# EAGLE design Integrator (EAGLE 6.4)
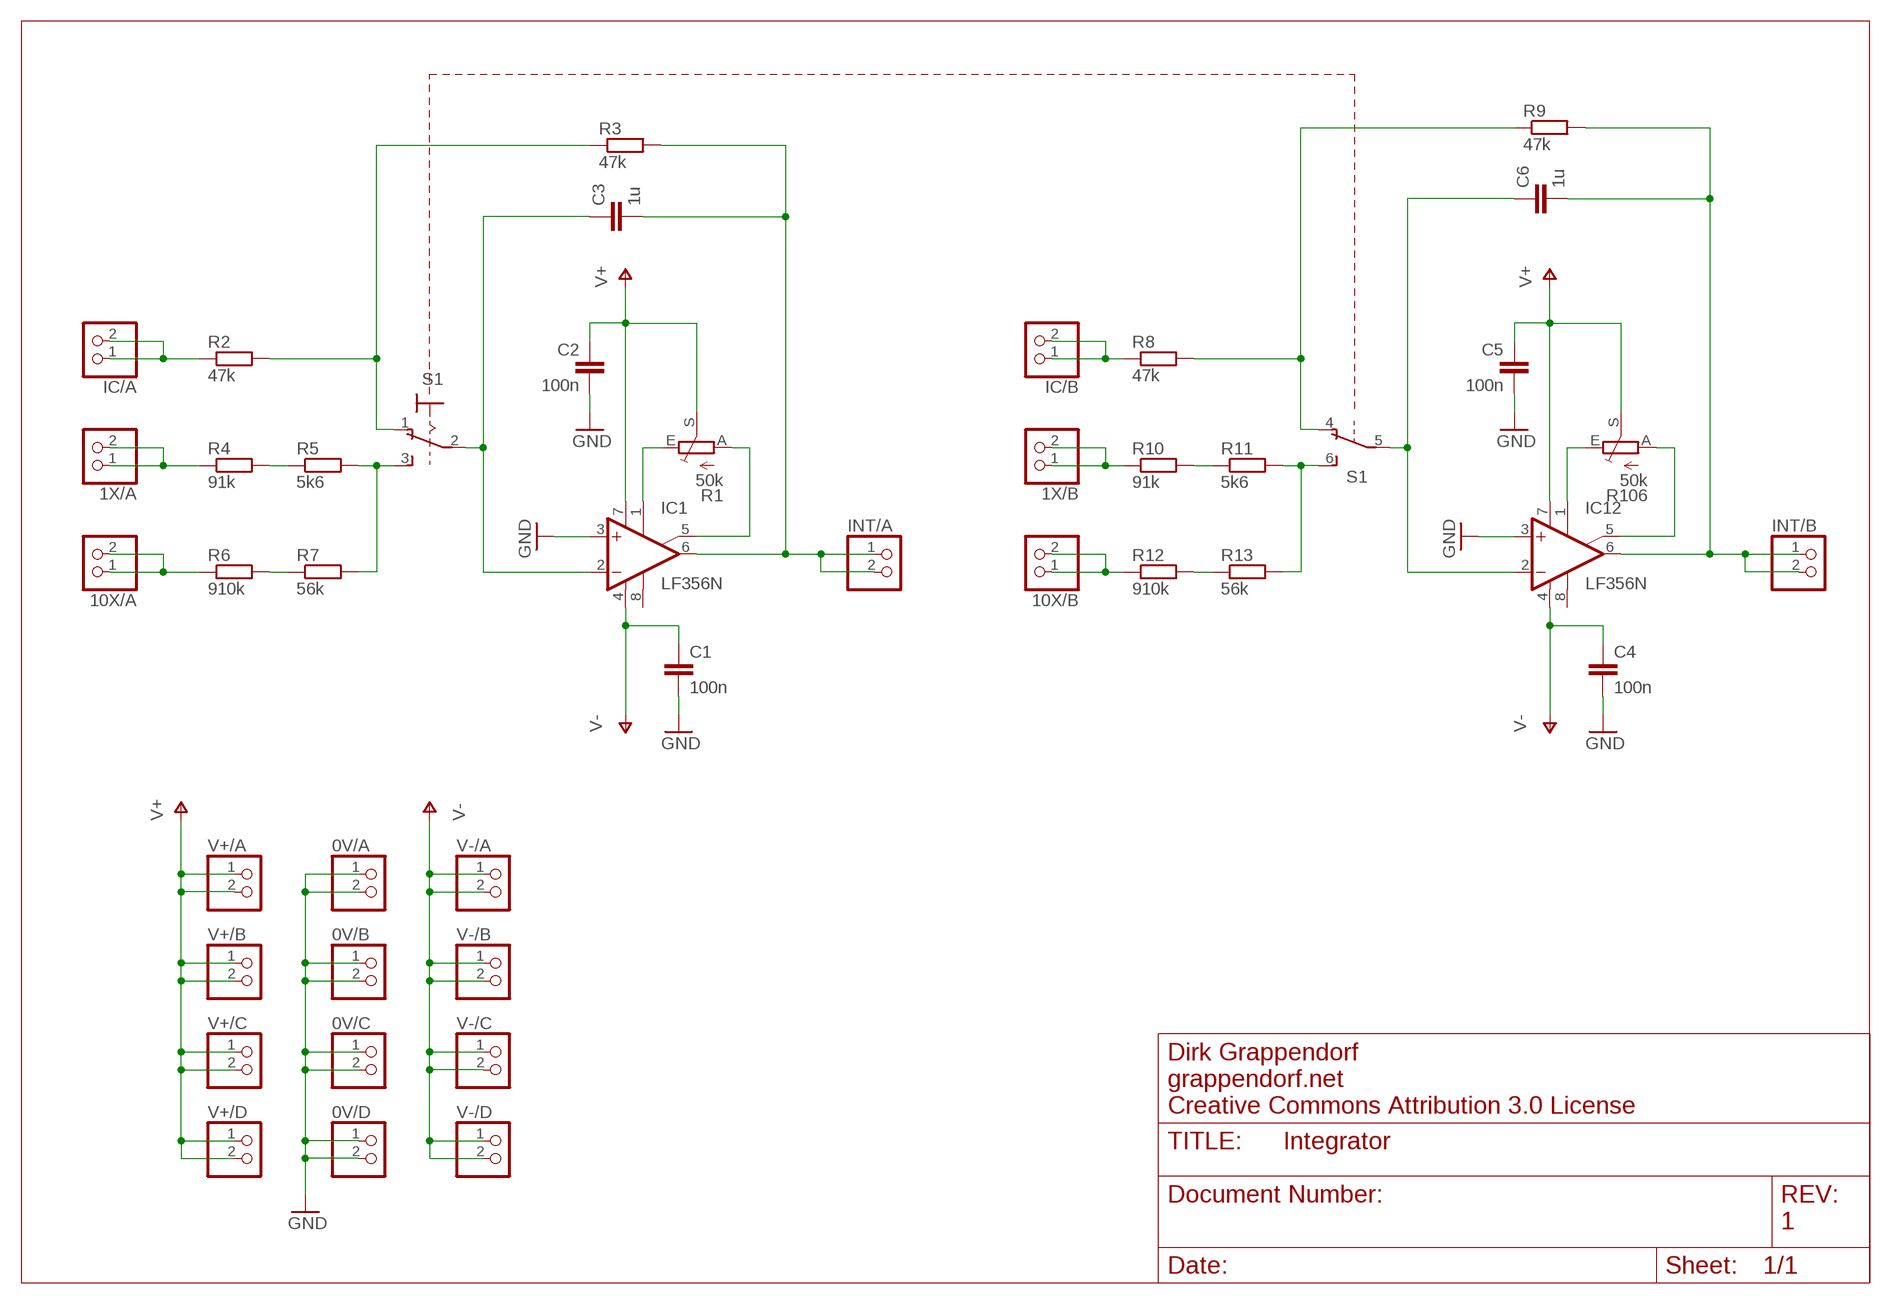
[diagram p0: schematic, sheet 1]

## Parts
0V/A  PINHD-1X2  [1X02]
0V/B  PINHD-1X2  [1X02]
0V/C  PINHD-1X2  [1X02]
0V/D  PINHD-1X2  [1X02]
1X/A  PINHD-1X2  [1X02]
1X/B  PINHD-1X2  [1X02]
10X/A  PINHD-1X2  [1X02]
10X/B  PINHD-1X2  [1X02]
C1  100n  C-EU025-025X050  [C025-025X050]
C2  100n  C-EU025-025X050  [C025-025X050]
C3  1u  C-EU050-035X075  [C050-035X075]
C4  100n  C-EU025-025X050  [C025-025X050]
C5  100n  C-EU025-025X050  [C025-025X050]
C6  1u  C-EU050-035X075  [C050-035X075]
IC1  LF356N  [DIL08]
IC12  LF356N  [DIL08]
IC/A  PINHD-1X2  [1X02]
IC/B  PINHD-1X2  [1X02]
INT/A  PINHD-1X2  [1X02]
INT/B  PINHD-1X2  [1X02]
R1  50k  TRIM_EU-LI15  [LI15]
R2  47k  R-EU_0207/7  [0207/7]
R3  47k  R-EU_0207/7  [0207/7]
R4  91k  R-EU_0207/7  [0207/7]
R5  5k6  R-EU_0207/7  [0207/7]
R6  910k  R-EU_0207/7  [0207/7]
R7  56k  R-EU_0207/7  [0207/7]
R8  47k  R-EU_0207/7  [0207/7]
R9  47k  R-EU_0207/7  [0207/7]
R10  91k  R-EU_0207/7  [0207/7]
R11  5k6  R-EU_0207/7  [0207/7]
R12  910k  R-EU_0207/7  [0207/7]
R13  56k  R-EU_0207/7  [0207/7]
R106  50k  TRIM_EU-LI15  [LI15]
S1  REICHELT-MS_500H  [REICHELT-MS_500H]
V+/A  PINHD-1X2  [1X02]
V+/B  PINHD-1X2  [1X02]
V+/C  PINHD-1X2  [1X02]
V+/D  PINHD-1X2  [1X02]
V-/A  PINHD-1X2  [1X02]
V-/B  PINHD-1X2  [1X02]
V-/C  PINHD-1X2  [1X02]
V-/D  PINHD-1X2  [1X02]

## Nets
GND: 0V/A.1 0V/A.2 0V/B.1 0V/B.2 0V/C.1 0V/C.2 0V/D.1 0V/D.2 C1.2 C2.2 C4.2 C5.2 IC1.3(+IN) IC12.3(+IN)
N$1: IC1.1(ON1) R1.E
N$2: IC1.5(ON2) R1.A
N$3: C3.2 IC1.6(OUT) INT/A.1 INT/A.2 R3.2
N$4: C3.1 IC1.2(-IN) S1.2(1:P)
N$5: 10X/A.1 10X/A.2 R6.1
N$6: 1X/A.1 1X/A.2 R4.1
N$7: IC/A.1 IC/A.2 R2.1
N$8: IC12.1(ON1) R106.E
N$9: IC12.5(ON2) R106.A
N$10: C6.2 IC12.6(OUT) INT/B.1 INT/B.2 R9.2
N$11: C6.1 IC12.2(-IN) S1.5(B:P)
N$12: 1X/B.1 1X/B.2 R10.1
N$13: 10X/B.1 10X/B.2 R12.1
N$14: IC/B.1 IC/B.2 R8.1
N$15: R4.2 R5.1
N$16: R6.2 R7.1
N$17: R10.2 R11.1
N$18: R12.2 R13.1
N$19: R5.2 R7.2 S1.3(1:S)
N$20: R11.2 R13.2 S1.6(B:S)
N$21: R2.2 R3.1 S1.1(1:O)
N$22: R8.2 R9.1 S1.4(B:O)
V+: C2.1 C5.1 IC1.7(V+) IC12.7(V+) R1.S R106.S V+/A.1 V+/A.2 V+/B.1 V+/B.2 V+/C.1 V+/C.2 V+/D.1 V+/D.2
V-: C1.1 C4.1 IC1.4(V-) IC12.4(V-) V-/A.1 V-/A.2 V-/B.1 V-/B.2 V-/C.1 V-/C.2 V-/D.1 V-/D.2
Unconnected: IC1.8(OPT) IC12.8(OPT)

## Notes on the sheet
- Dirk Grappendorf
- grappendorf.net
- Creative Commons Attribution 3.0 License
- 1

## Library data of the parts
0V/A 0V/B 0V/C 0V/D 1X/A 1X/B 10X/A 10X/B IC/A IC/B INT/A INT/B V+/A V+/B V+/C V+/D V-/A V-/B V-/C V-/D = pinhead:PINHD-1X2: PIN HEADER
C1-C6 = rcl:C-EU: CAPACITOR, European symbol
IC1 IC12 = linear:LF356: OP AMP
R1 R106 = pot:TRIM_EU-: POTENTIOMETER
R2-R13 = rcl:R-EU_: RESISTOR, European symbol
S1 = grapelabs-switches:REICHELT-MS_500H: TOGGLE SWITCH distributor RS Components

## Board
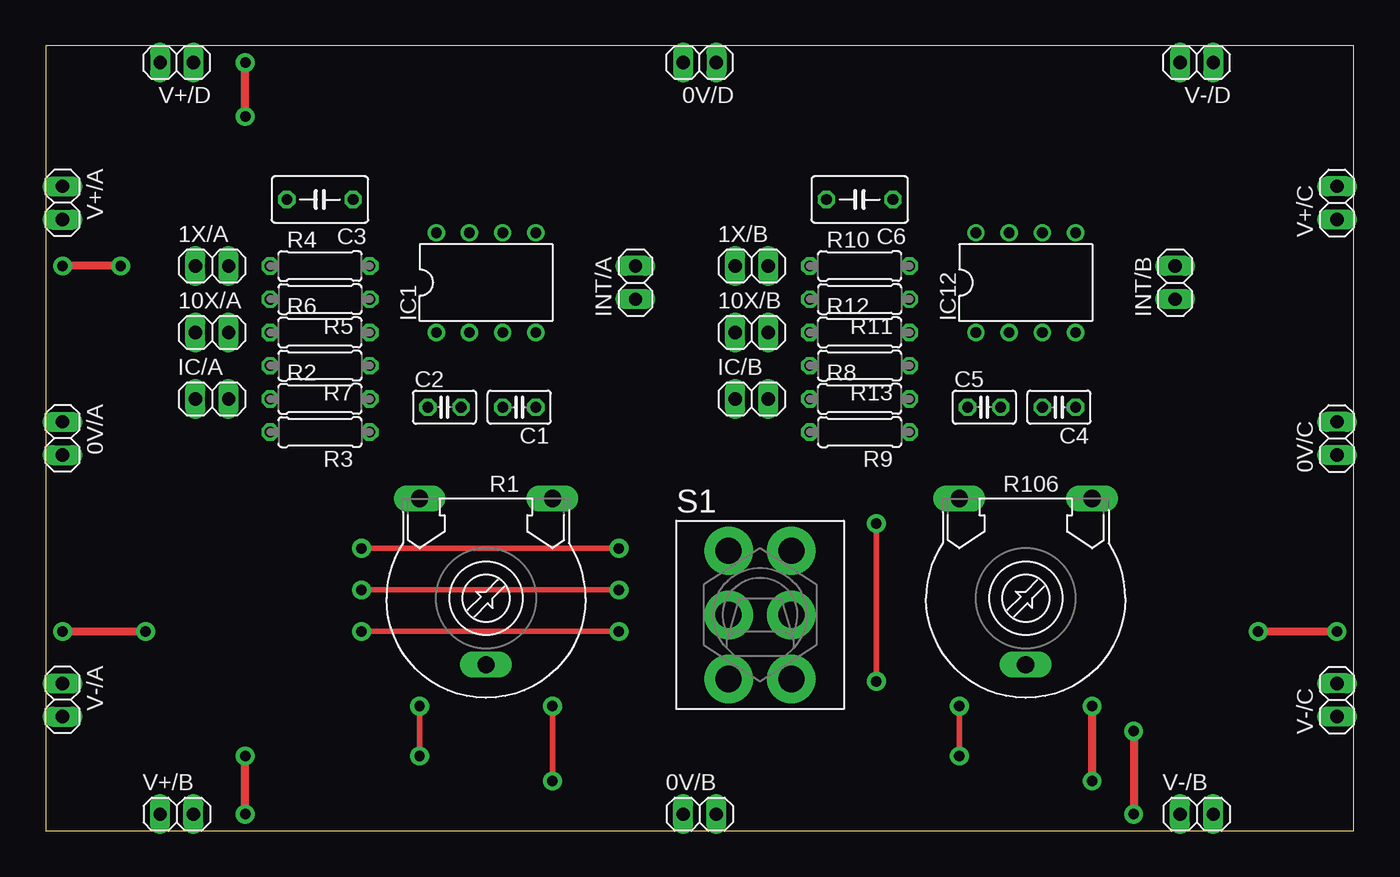
[diagram p1: board, top side]
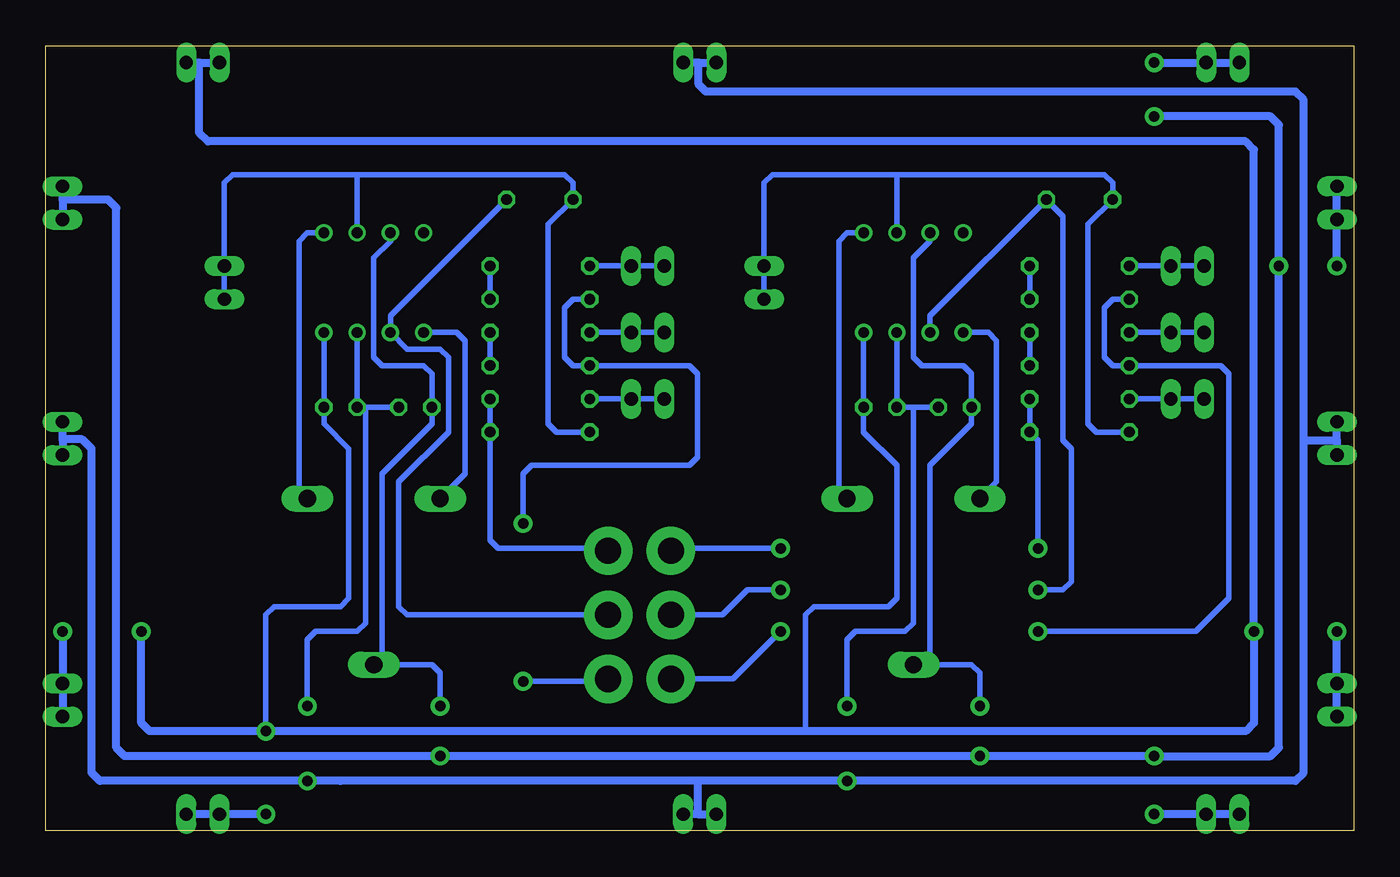
[diagram p2: board, bottom side, seen from below]

Size 100 x 60 mm. Coordinates in mm from the lower left corner, seen from the top.
Outline: 0,0 100,0 100,60 0,60 0,0
Copper layers (1*16): Top 0.035mm / dielectric 1.5mm / Bottom 0.035mm
Design rules "default *": minimum track width 10mil, minimum drill 24mil, track to track 8mil, track to pad 8mil, pad to pad 8mil, via to via 8mil, smd to smd 8mil, copper to edge 40mil, drill to drill 8mil, minimum pad ring 10mil, minimum via ring 8mil, stop-mask expansion 4mil, vias tented up to drill 0mil, thermal gap 10mil

### Footprints (pad centres in the part's own frame; a part is rotated, then mirrored left to right if it is on the bottom)
1X02 = drill 1.016 long: 1 -1.27,0; 2 1.27,0
C025-025X050 = drill 0.813 octagon: 1 -1.27,0; 2 1.27,0
C050-035X075 = drill 0.813 octagon: 1 -2.54,0; 2 2.54,0
DIL08 = drill 0.813 pad 1.27: 1 -3.81,-3.81; 2 -1.27,-3.81; 3 1.27,-3.81; 4 3.81,-3.81; 5 3.81,3.81; 6 1.27,3.81; 7 -1.27,3.81; 8 -3.81,3.81
LI15 = drill 1.321 long: A -5.08,-7.62; E 5.08,-7.62; S 0,5.08
0207/7 = drill 0.813 octagon: 1 -3.81,0; 2 3.81,0
REICHELT-MS_500H = drill 2 pad 3.7: 1 -2.4,4.9; 2 -2.4,0; 3 -2.4,-4.9; 4 2.4,4.9; 5 2.4,0; 6 2.4,-4.9

### Placement (x,y rotation side)
0V/A  1.27,30 270 top
0V/B  50,1.27 0 top
0V/C  98.73,30 90 top
0V/D  50,58.73 180 top
1X/A  12.7,43.18 0 top
1X/B  53.98,43.18 0 top
10X/A  12.7,38.1 0 top
10X/B  53.98,38.1 0 top
C1  36.2,32.38 180 top
C2  30.48,32.38 0 top
C3  20.95,48.26 180 top
C4  77.47,32.38 180 top
C5  71.75,32.38 0 top
C6  62.23,48.26 180 top
IC1  33.66,41.91 0 top
IC12  74.93,41.91 0 top
IC/A  12.7,33.02 0 top
IC/B  53.98,33.02 0 top
INT/A  45.09,41.91 90 top
INT/B  86.36,41.91 90 top
R1  33.66,17.78 180 top
R2  20.95,33.02 0 top
R3  20.95,30.48 180 top
R4  20.95,43.18 0 top
R5  20.95,40.64 180 top
R6  20.95,38.1 0 top
R7  20.95,35.56 180 top
R8  62.23,33.02 0 top
R9  62.23,30.48 180 top
R10  62.23,43.18 0 top
R11  62.23,40.64 180 top
R12  62.23,38.1 0 top
R13  62.23,35.56 180 top
R106  74.93,17.78 180 top
S1  54.61,16.51 0 top
V+/A  1.27,48 270 top
V+/B  10,1.27 0 top
V+/C  98.73,48 90 top
V+/D  10,58.73 180 top
V-/A  1.27,10 270 top
V-/B  88,1.27 0 top
V-/C  98.73,10 90 top
V-/D  88,58.73 180 top

### Tracks (layer width: path | path; a pad name or v marks a point on that pad's centre or on a via)
GND  (via drill 0.8)
  Top 0.406: v38.73,3.81 v38.73,9.53
  Top 0.61: v80.01,3.81 v80.01,9.53
  Bottom 0.406: IC1.3 C1.2 33.66,32.38 | v38.73,9.53 38.73,14.61 38.1,15.24 34.29,15.24 33.66,15.88 33.66,32.38 | 33.66,32.38 C2.2 | IC12.3 C4.2 75.56,32.38 | v80.01,9.53 80.01,14.61 79.38,15.24 76.2,15.24 75.56,15.88 75.56,32.38 | 75.56,32.38 C5.2
  Bottom 0.61: 1.27,29.84 0V/A.2 | 1.27,29.84 0V/A.1 | 50.08,58.73 0V/D.2 | 50.08,58.73 0V/D.1 | 98.73,29.93 0V/C.1 98.48,28.48 | 98.73,29.93 0V/C.2 | 50.16,1.27 0V/B.1 | 50.16,1.27 0V/B.2 | 3.81,29.84 3.81,5.08 3.81,4.45 4.45,3.81 v38.73,3.81 50.16,3.81 | 3.81,29.84 3.81,55.88 4.45,56.52 49.53,56.52 50.08,57.06 50.08,58.73 | 50.16,3.81 77.47,3.81 | 77.47,3.81 v80.01,3.81 | v80.01,3.81 95.89,3.81 96.52,4.45 96.52,29.21 97.24,29.93 98.73,29.93 | 3.81,29.84 1.27,29.84 | 50.16,3.81 50.16,1.27 | 77.47,3.81 v80.01,3.81
N$1
  Bottom 0.406: IC1.1 27.94,38.1 27.3,37.47 27.3,26.67 R1.E
N$2
  Bottom 0.406: IC1.5 38.73,45.72 39.37,45.09 39.37,26.04 R1.A
N$3
  Bottom 0.406: INT/A.1 INT/A.2 45.09,49.53 44.45,50.16 34.92,50.16 | R3.2 19.68,30.48 20.32,31.11 20.32,46.35 C3.2 18.41,49.53 19.05,50.16 34.92,50.16 | 34.92,50.16 IC1.6
N$4  (via drill 0.8)
  Top 0.406: v24.13,18.41 v43.81,18.41
  Bottom 0.406: v43.81,18.41 46.35,18.41 48.26,16.51 S1.2 | IC1.2 32.38,39.37 C3.1 22.23,46.99 22.23,29.84 21.59,29.21 21.59,19.05 22.23,18.41 v24.13,18.41
N$5
  Bottom 0.406: 10X/A.1 10X/A.2 R6.1
N$6
  Bottom 0.406: 1X/A.1 1X/A.2 R4.1
N$7
  Bottom 0.406: IC/A.1 IC/A.2 R2.1
N$8
  Bottom 0.406: IC12.1 68.58,38.1 67.94,37.47 67.94,27.3 R106.E
N$9
  Bottom 0.406: IC12.5 80.01,45.72 80.64,45.09 80.64,26.04 R106.A
N$10
  Bottom 0.406: INT/B.1 INT/B.2 86.36,49.53 85.72,50.16 76.2,50.16 | R9.2 60.96,30.48 61.59,31.11 61.59,46.35 C6.2 59.69,49.53 60.33,50.16 76.2,50.16 | 76.2,50.16 IC12.6
N$11
  Bottom 0.406: S1.5 72.39,16.51 73.03,17.14 73.03,26.67 69.22,30.48 69.22,36.2 69.85,36.83 72.39,36.83 IC12.2 73.66,39.37 C6.1
N$12
  Bottom 0.406: 1X/B.1 1X/B.2 R10.1
N$13
  Bottom 0.406: 10X/B.1 10X/B.2 R12.1
N$14
  Bottom 0.406: IC/B.1 IC/B.2 R8.1
N$15
  Bottom 0.406: R5.1 R4.2
N$16
  Bottom 0.406: R7.1 R6.2
N$17
  Bottom 0.406: R11.1 R10.2
N$18
  Bottom 0.406: R13.1 R12.2
N$19  (via drill 0.8)
  Top 0.406: v24.13,15.24 v43.81,15.24
  Bottom 0.406: R5.2 18.41,40.64 19.05,40.01 19.05,36.2 18.41,35.56 17.78,35.56 | 17.78,35.56 R7.2 | S1.3 47.45,11.61 v43.81,15.24 | v24.13,15.24 12.06,15.24 9.53,17.78 9.53,34.92 10.16,35.56 17.78,35.56
N$20  (via drill 0.8)
  Top 0.406: v63.5,11.43 v63.5,23.5
  Bottom 0.406: R11.2 59.69,40.64 60.33,40.01 60.33,36.2 59.69,35.56 R13.2 50.8,35.56 50.16,34.92 50.16,28.57 50.8,27.94 62.87,27.94 63.5,27.3 v63.5,23.5 | v63.5,11.43 57.19,11.43 S1.6
N$21  (via drill 0.8)
  Top 0.406: v24.13,21.59 v43.81,21.59
  Bottom 0.406: R2.2 R3.1 24.13,29.84 v24.13,21.59 | v43.81,21.59 52.03,21.59 S1.1
N$22
  Bottom 0.406: R8.2 R9.1 66.04,22.23 65.41,21.59 57.19,21.59 S1.4
V+  (via drill 0.8)
  Top 0.406: v28.57,5.71 v28.57,9.53 | v69.85,5.71 v69.85,9.53
  Top 0.61: v5.71,43.18 v1.27,43.18 | v15.24,1.27 v15.24,5.71 | v15.24,54.61 v15.24,58.73
  Bottom 0.406: IC1.7 32.38,45.09 33.66,43.81 33.66,36.2 33.02,35.56 29.84,35.56 29.21,34.92 C2.1 29.21,31.11 32.38,27.94 32.38,12.7 | v28.57,9.53 28.57,12.06 29.21,12.7 32.38,12.7 | 32.38,12.7 R1.S | v69.85,9.53 69.85,12.06 70.48,12.7 72.39,12.7 | 72.39,12.7 74.3,12.7 | 74.3,12.7 R106.S | 72.39,12.7 74.3,12.7 | 74.3,12.7 74.3,27.3 70.48,31.11 C5.1 70.48,34.92 71.12,35.56 74.3,35.56 74.93,36.2 74.93,43.81 73.66,45.09 IC12.7
  Bottom 0.61: v1.27,43.18 V+/A.2 V+/A.1 | V+/D.2 V+/D.1 14.91,58.73 v15.24,58.73 | 98.73,48.26 V+/C.1 | 98.73,48.26 V+/C.2 | V+/B.1 V+/B.2 15.05,1.27 v15.24,1.27 | v5.71,43.18 5.71,6.35 6.35,5.71 v15.24,5.71 v28.57,5.71 v69.85,5.71 93.98,5.71 94.61,6.35 94.61,47.62 95.25,48.26 98.73,48.26 | v5.71,43.18 5.71,43.72 | v15.24,54.61 6.35,54.61 5.71,53.98 v5.71,43.18
V-  (via drill 0.8)
  Top 0.61: v1.27,15.24 v7.62,15.24 | v92.71,15.24 v98.73,15.24 | v83.19,7.62 v83.19,1.27
  Bottom 0.406: IC1.4 C1.1 37.47,31.11 37.47,30.48 34.92,27.94 34.92,17.78 35.56,17.14 41.27,17.14 41.91,16.51 41.91,7.62 | v83.19,7.62 83.19,16.51 82.55,17.14 77.47,17.14 76.83,17.78 76.83,29.21 78.74,31.11 C4.1 IC12.4
  Bottom 0.61: V-/A.2 V-/A.1 1.27,15.05 v1.27,15.24 | V-/C.1 V-/C.2 98.73,14.91 v98.73,15.24 | V-/B.2 V-/B.1 v83.19,1.27 | 88.27,58.73 V-/D.2 | 88.27,58.73 V-/D.1 | v92.71,15.24 92.71,8.26 92.08,7.62 v83.19,7.62 41.91,7.62 8.26,7.62 7.62,8.26 v7.62,15.24 7.62,52.07 8.26,52.7 87.63,52.7 88.27,53.34 88.27,58.73